# EAGLE design Receiver (EAGLE 6.3)
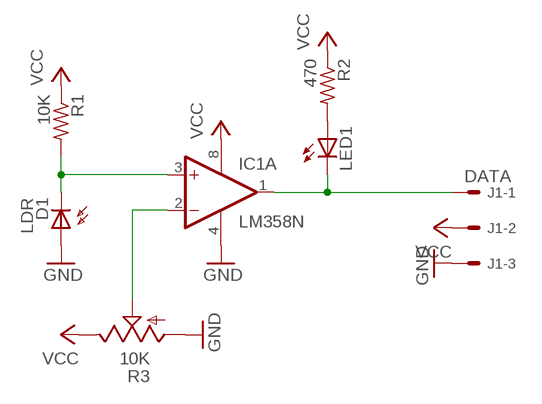
[diagram p0: schematic, sheet 1]

## Parts
D1  LDR  PHOTODIODE  [LED3MM]
IC1  LM358N  [DIL08]
J1  DATA  CON_MOLEX-05-7038-03  [7395-03]
LED1  LED3MM  [LED3MM]
R1  10K  RESISTOR0204/7  [0204/7]
R2  470  RESISTOR0204/7  [0204/7]
R3  10K  TRIMPOTCA6V  [CA6V]

## Nets
GND [pwr]: D1.A IC1.4(P:V-) J1.3 R3.A
N$1: D1.K(C) IC1.3(A:+IN) R1.2
N$2: LED1.A R2.2
N$3: IC1.1(A:OUT) J1.1 LED1.K(C)
N$4: IC1.2(A:-IN) R3.S
VCC [pwr]: IC1.8(P:V+) J1.2 R1.1 R2.1 R3.E
Unconnected: IC1.5(B:+IN) IC1.6(B:-IN) IC1.7(B:OUT)

## Library data of the parts
D1 = barelang-store:PHOTODIODE: PHOTO DIODE
IC1 = linear:LM358: OP AMP also LM158; LM258; LM2904 Source: http://cache.national.com/ds/LM/LM158.pdf
J1 = barelang-store:CON_MOLEX-?-03: CONNECTOR wire to board 2.54 mm (.1 inch) pitch header; OC_FARNELL: unknown; OC_NEWARK: unknown
LED1 = led:LED: LED OSRAM: - CHIPLED LG R971, LG N971, LY N971, LG Q971, LY Q971, LO R971, LY R971 LH N974, LH R974 LS Q976, LO Q976, LY Q976 LO Q996 - Hyper CHIPLED LW Q18S LB Q993, LB Q99A, LB R99A - SideLED LS A670, LO A670, LY A670, LG A670, LP A670 LB A673, LV A673, LT A673, LW A673 LH A674 LY A675 LS A676, LA A676, LO A676, LY A676, LW A676 LS A679, LY A679, LG A679 - Hyper Micro SIDELED® LS Y876, LA Y876, LO Y876, LY Y876 LT Y87S - SmartLED LW L88C, LW L88S LB L89C, LB L89S, LG L890 LS L89K, LO L89K, LY L89K LS L896, LA L896, LO L896, LY L896 - TOPLED LS T670, LO T670, LY T670, LG T670, LP T670 LSG T670, LSP T670, LSY T670, LOP T670, LYG T670 LG T671, LOG T671, LSG T671 LB T673, LV T673, LT T673, LW T673 LH T674 LS T676, LA T676, LO T676, LY T676, LB T676, LH T676, LSB T676, LW T676 LB T67C, LV T67C, LT T67C, LS T67K, LO T67K, LY T67K, LW E67C LS E67B, LA E67B, LO E67B, LY E67B, LB E67C, LV E67C, LT E67C LW T67C LS T679, LY T679, LG T679 LS T770, LO T770, LY T770, LG T770, LP T770 LB T773, LV T773, LT T773, LW T773 LH T774 LS E675, LA E675, LY E675, LS T675 LS T776, LA T776, LO T776, LY T776, LB T776 LHGB T686 LT T68C, LB T68C - Hyper Mini TOPLED® LB M676 - Mini TOPLED Santana® LG M470 LS M47K, LO M47K, LY M47K Source: http://www.osram.convergy.de LUXEON: - LUMILED® LXK2-PW12-R00, LXK2-PW12-S00, LXK2-PW14-U00, LXK2-PW14-V00 LXK2-PM12-R00, LXK2-PM12-S00, LXK2-PM14-U00 LXK2-PE12-Q00, LXK2-PE12-R00, LXK2-PE12-S00, LXK2-PE14-T00, LXK2-PE14-U00 LXK2-PB12-K00, LXK2-PB12-L00, LXK2-PB12-M00, LXK2-PB14-N00, LXK2-PB14-P00, LXK2-PB14-Q00 LXK2-PR12-L00, LXK2-PR12-M00, LXK2-PR14-Q00, LXK2-PR14-R00 LXK2-PD12-Q00, LXK2-PD12-R00, LXK2-PD12-S00 LXK2-PH12-R00, LXK2-PH12-S00 LXK2-PL12-P00, LXK2-PL12-Q00, LXK2-PL12-R00 Source: www.luxeon.com KINGBRIGHT: KA-3528ASYC Source: www.kingbright.com
R1 R2 = barelang-store:RESISTOR: RESISTOR, American symbol
R3 = barelang-store:TRIMPOT: POTENTIOMETER

## Net classes
0 default: width 0.4 mm
1 pwr: width 0.5 mm

## Board
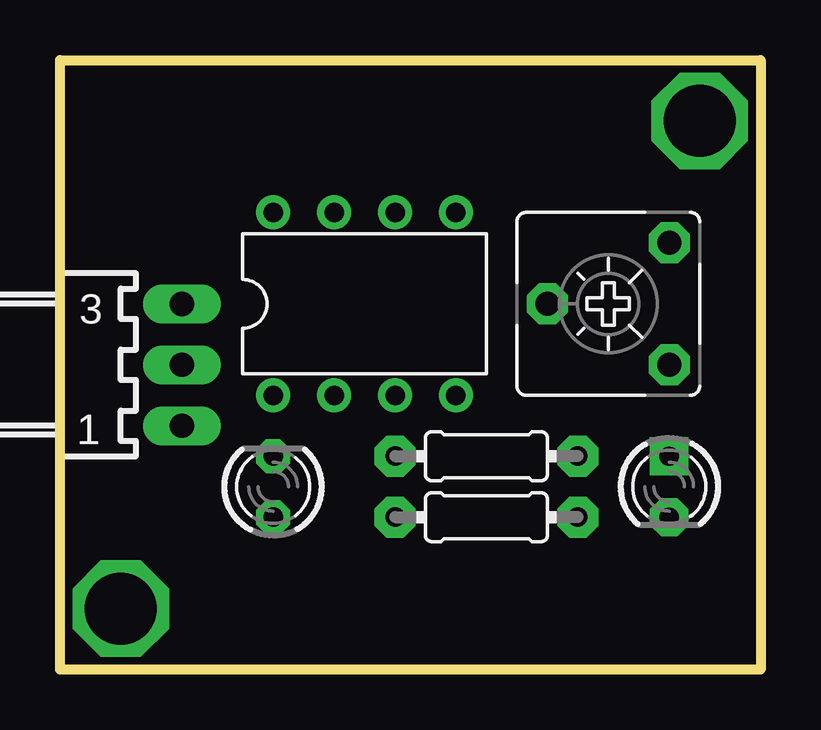
[diagram p1: board, top side]
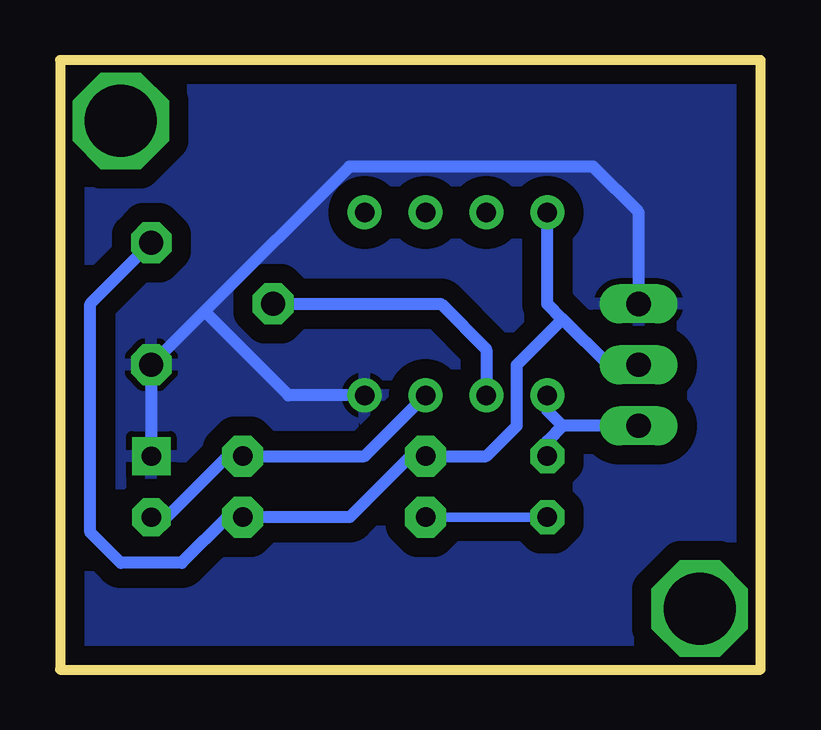
[diagram p2: board, bottom side, seen from below]

Size 29.21 x 25.4 mm. Coordinates in mm from the lower left corner, seen from the top.
Outline: 0,25.4 29.21,25.4 29.21,0 0,0 0,25.4
Copper layers (1*16): Top 0.035mm / dielectric 1.5mm / Bottom 0.035mm
Design rules "SparkFun": minimum track width 8mil, minimum drill 20mil, track to track 8mil, track to pad 8mil, pad to pad 8mil, via to via 8mil, smd to smd 8mil, copper to edge 10mil, drill to drill 8mil, minimum pad ring 12mil, minimum via ring 10mil, stop-mask expansion 4mil, vias tented up to drill 25mil, thermal gap 10mil

### Footprints (pad centres in the part's own frame; a part is rotated, then mirrored left to right if it is on the bottom)
LED3MM = drill 0.8 pad 1.6 square: A -1.27,0 | drill 0.8 pad 1.6 octagon: K 1.27,0
DIL08 = drill 0.813 pad 1.27: 1 -3.81,-3.81; 2 -1.27,-3.81; 3 1.27,-3.81; 4 3.81,-3.81; 5 3.81,3.81; 6 1.27,3.81; 7 -1.27,3.81; 8 -3.81,3.81
7395-03 = drill 1.016 long: 1 2.54,0; 2 0,0; 3 -2.54,0
LED3MM' = drill 0.813 octagon: A -1.27,0; K 1.27,0
0204/7 = drill 0.813 pad 1.7 octagon: 1 -3.81,0; 2 3.81,0
CA6V = drill 1 pad 1.7 octagon: A -2.54,-2.54; E 2.54,-2.54; S 0,2.54

### Placement (x,y rotation side)
D1  25.4,7.62 270 top
IC1  12.7,15.24 0 top
J1  5.08,12.7 270 top
LED1  [LED3MM']  8.89,7.62 90 top
R1  17.78,8.89 0 top
R2  17.78,6.35 180 top
R3  22.86,15.24 90 top

### Tracks (layer width: path | path; a pad name or v marks a point on that pad's centre or on a via)
GND
  Bottom 0.5: 23.18,14.92 R3.A D1.A | 23.18,14.92 17.14,20.95 6.99,20.95 5.08,19.05 J1.3 | IC1.4 19.69,11.43 23.18,14.92
  pour Bottom (isolate 0.8): 0,25.4 29.21,25.4 29.21,0 0,0
N$1
  Bottom 0.5: D1.K 24.77,6.35 22.23,8.89 R1.2 16.51,8.89 IC1.3
N$2
  Bottom 0.4: LED1.A R2.2
N$3
  Bottom 0.5: J1.1 8.26,10.16 | 8.26,10.16 8.89,9.53 LED1.K | IC1.1 8.89,10.79 8.26,10.16
N$4
  Bottom 0.5: R3.S 13.34,15.24 11.43,13.33 IC1.2
N$6  (via drill 3)
  other vias: 26.67,22.86
N$8  (via drill 3)
  other vias: 2.54,2.54
VCC
  Bottom 0.5: R3.E 27.94,15.24 27.94,5.71 26.67,4.45 24.13,4.45 22.23,6.35 R2.1 17.13,6.35 14.59,8.89 R1.1 11.43,8.89 10.16,10.16 10.16,12.7 8.26,14.61 | J1.2 6.35,12.7 8.26,14.61 | 8.26,14.61 8.89,15.24 IC1.8